# EAGLE schematic QRD (EAGLE 7.3.0)
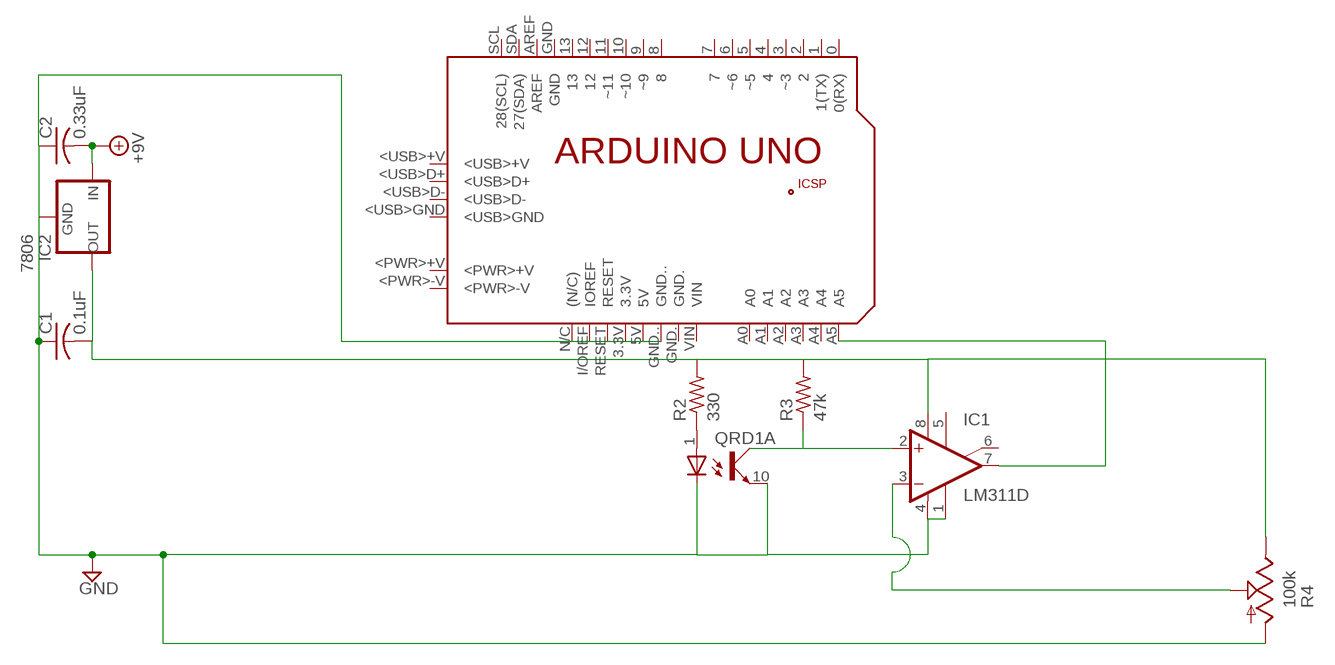
[diagram p0: schematic, sheet 1]

## Parts
C1  0.1uF  C-US025-024X044  [C025-024X044]
C2  0.33uF  C-US025-024X044  [C025-024X044]
IC1  LM311D  [SO08]
IC2  7806  78XXL  [78XXL]
PCB1  ARDUINO_UNO  [ARDUINO_UNO]
QRD1  SFH6943  [SOT223/10]
R2  330  R-US_0204/2V  [0204V]
R3  47k  R-US_0204/2V  [0204V]
R4  100k  TRIM_US-3223G  [3223G]

## Nets
+9V: C2.2 IC2.IN
GND: C1.1 C2.1 IC1.1(GND) IC1.4(V-) IC2.GND PCB1.GND.. QRD1.10(A:EMI) R4.1(A)
N$1: IC1.7(OUT) PCB1.A5
N$3: QRD1.1(A:A) R2.1
N$4: IC1.3(-IN) R4.2(S)
N$5: IC1.2(+IN) R3.1
N$6: C1.2 IC1.8(V+) IC2.OUT R2.2 R3.2 R4.3(E)
Unconnected: IC1.5(ON) IC1.6(ON/STR) PCB1.0(0(RX)) PCB1.1(1(TX)) PCB1.2 PCB1.3(~3) PCB1.3.3V PCB1.4 PCB1.5(~5) PCB1.5V PCB1.6(~6) PCB1.7 PCB1.8 PCB1.9(~9) PCB1.10(~10) PCB1.11(~11) PCB1.12 PCB1.13 PCB1.+5V PCB1.<PWR>+V PCB1.<PWR>-V PCB1.<USB>+V PCB1.<USB>D+ PCB1.<USB>D- PCB1.<USB>GND PCB1.A0 PCB1.A1 PCB1.A2 PCB1.A3 PCB1.A4 PCB1.AREF PCB1.GND PCB1.GND. PCB1.GND_ PCB1.I/OREF(IOREF) PCB1.MISO PCB1.MOSI PCB1.N/C((N/C)) PCB1.RESET PCB1.RESET. PCB1.SCK PCB1.SCL(28(SCL)) PCB1.SDA(27(SDA)) PCB1.VIN QRD1.2(B:A) QRD1.3(P:COM-CAT) QRD1.4(C:A) QRD1.5(D:A) QRD1.6(D:EMI) QRD1.7(C:EMI) QRD1.8(P:COM-COL) QRD1.9(B:EMI)

## Library data of the parts
C1 C2 = resistor:C-US: CAPACITOR, American symbol
IC1 = linear:LM311: COMPARATOR
IC2 = v-reg:78XXL: VOLTAGE REGULATOR
PCB1 = E14_Arduino_revB:ARDUINO_UNO: Device for representing an Arduino Uno board with a footprint in an EAGLE design. Created by Dave Young for Element14. More EAGLE documentation at: http://www.element14.com/community/community/knode/cadsoft_eagle
QRD1 = opto-vishay:SFH6943: Optocoupler, Phototransistor Output Quad Channel Source: http://www.vishay.com/docs/83688/83688.pdf; MPN: SFH6943A-4T; OC_FARNELL: 1045530; OC_NEWARK: 66M1324
R2 R3 = resistor:R-US_: RESISTOR, American symbol
R4 = pot:TRIM_US-: POTENTIOMETER